# EAGLE design rover (EAGLE 7.7.0)

## Sheet 1 of 4
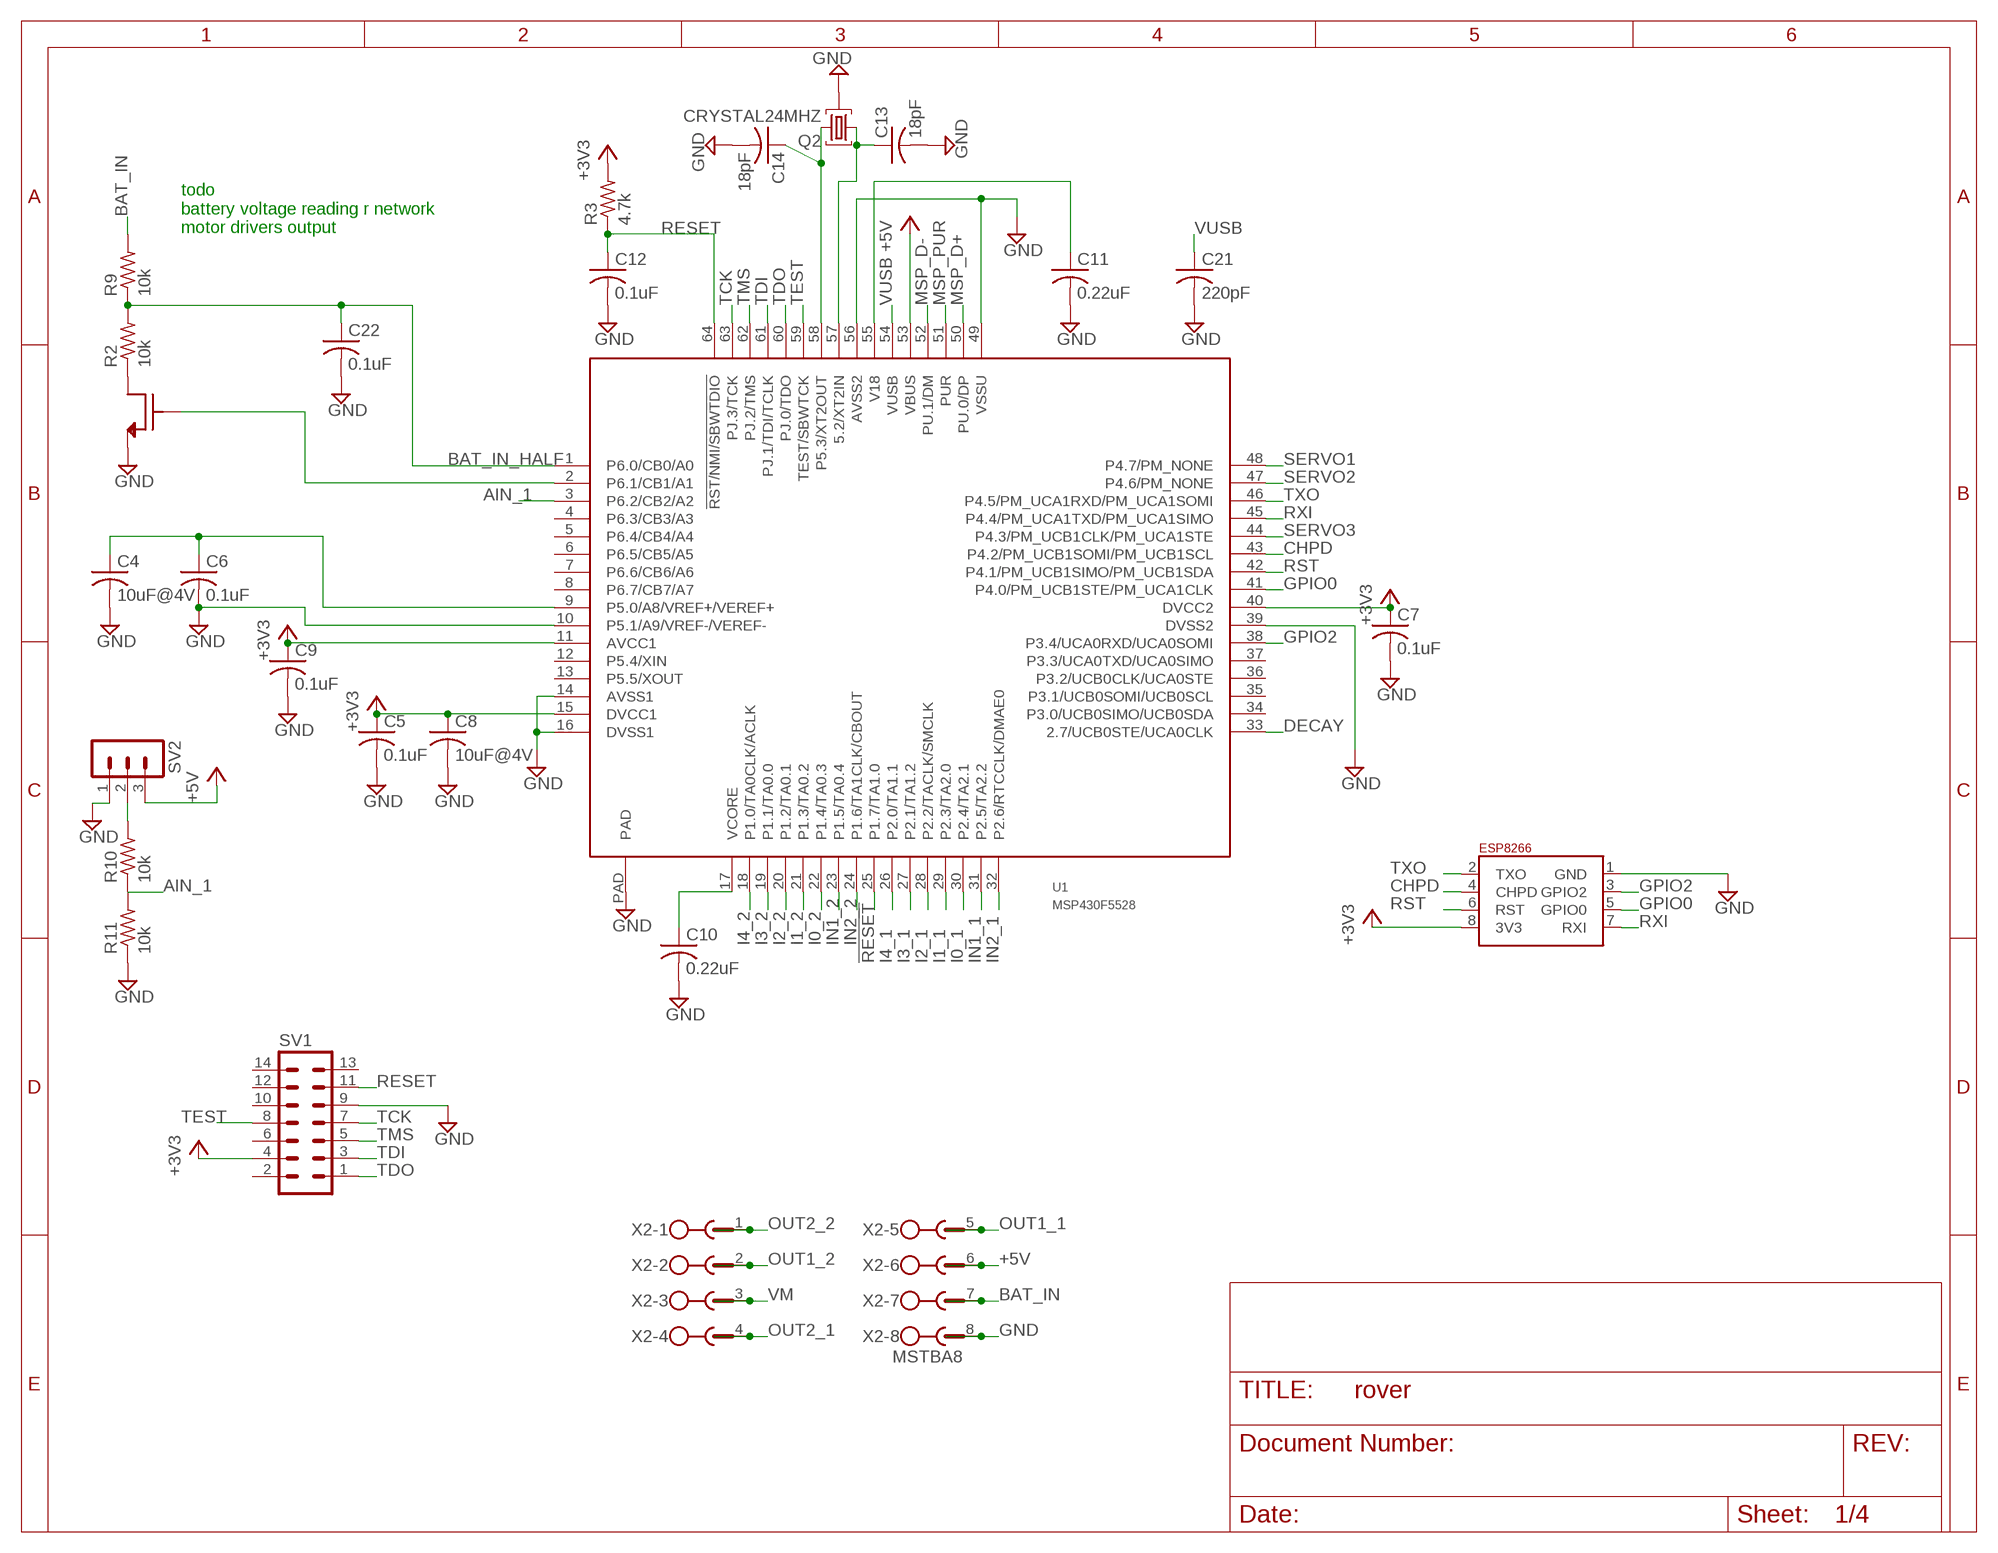
[diagram p0: schematic, sheet 1]

### Parts
C4  10uF@4V  C-US10UFC0603  [C0603]
C5  0.1uF  C-US0.1UFC0603  [C0603]
C6  0.1uF  C-US0.1UFC0603  [C0603]
C7  0.1uF  C-US0.1UFC0603  [C0603]
C8  10uF@4V  C-US10UFC0603  [C0603]
C9  0.1uF  C-US0.1UFC0603  [C0603]
C10  0.22uF  C-US0.22UFC0603  [C0603]
C11  0.22uF  C-US0.22UFC0603  [C0603]
C12  0.1uF  C-US0.1UFC0603  [C0603]
C13  18pF  C-US18PFC0603  [C0603]
C14  18pF  C-US18PFC0603  [C0603]
C21  220pF  C-US-220PF-C0603  [C0603]
C22  0.1uF  C-US0.1UFC0603  [C0603]
Q2  CRYSTAL24MHZ  [ABM8]
R2  10k  R-US_10KR0603  [R0603]
R3  4.7k  R-US_4.7KR0603  [R0603]
R9  10k  R-US_10KR0603  [R0603]
R10  10k  R-US_10KR0603  [R0603]
R11  10k  R-US_10KR0603  [R0603]
SV1  MA07-2THM  [MA07-2]
SV2  MA03-1RND  [MA03-1-ROUND]
U1  MSP430F5528  [-RGC-N64]
U3  NMOS2N7002P  [2N7002P-235]
U15  ESP8266  [ESP8266]
X2  MSTBA8  [MSTBA8]

### Nets
!RESET: U1.25(P1.7/TA1.0) ; also sheet 3,4
+3V3: C5.1 C7.1 C8.1 C9.1 R3.2 SV1.4 U1.11(AVCC1) U1.15(DVCC1) U1.40(DVCC2) U15.8(3V3) ; also sheet 2,3,4
+5V: SV2.3 U1.53(VBUS) X2.6 ; also sheet 2
AIN_1: R10.1 R11.2 U1.3(P6.2/CB2/A2)
BAT_IN: R9.2 X2.7
BAT_IN_HALF: C22.1 R2.2 R9.1 U1.1(P6.0/CB0/A0)
CHPD: U1.43(P4.2/PM_UCB1SOMI/PM_UCB1SCL) U15.4(CHPD)
DECAY: U1.33(2.7/UCB0STE/UCA0CLK) ; also sheet 3,4
GND: C4.2 C5.2 C6.2 C7.2 C8.2 C9.2 C10.2 C11.2 C12.2 C13.2 C14.2 C21.2 C22.2 Q2.2 Q2.4 R11.1 SV1.9 SV2.1 U1.10(P5.1/A9/VREF-/VEREF-) U1.14(AVSS1) U1.16(DVSS1) U1.39(DVSS2) U1.49(VSSU) U1.56(AVSS2) U1.PAD U3.3(D) U15.1(GND) X2.8 ; also sheet 2,3,4
GPIO0: U1.41(P4.0/PM_UCB1STE/PM_UCA1CLK) U15.5(GPIO0)
GPIO2: U1.38(P3.4/UCA0RXD/UCA0SOMI) U15.3(GPIO2)
I0_1: U1.30(P2.4/TA2.1) ; also sheet 3
I0_2: U1.22(P1.4/TA0.3) ; also sheet 4
I1_1: U1.29(P2.3/TA2.0) ; also sheet 3
I1_2: U1.21(P1.3/TA0.2) ; also sheet 4
I2_1: U1.28(P2.2/TACLK/SMCLK) ; also sheet 3
I2_2: U1.20(P1.2/TA0.1) ; also sheet 4
I3_1: U1.27(P2.1/TA1.2) ; also sheet 3
I3_2: U1.19(P1.1/TA0.0) ; also sheet 4
I4_1: U1.26(P2.0/TA1.1) ; also sheet 3
I4_2: U1.18(P1.0/TA0CLK/ACLK) ; also sheet 4
IN1_1: U1.31(P2.5/TA2.2) ; also sheet 3
IN1_2: U1.23(P1.5/TA0.4) ; also sheet 4
IN2_1: U1.32(P2.6/RTCCLK/DMAE0) ; also sheet 3
IN2_2: U1.24(P1.6/TA1CLK/CBOUT) ; also sheet 4
MSP_D+: U1.50(PU.0/DP) ; also sheet 2
MSP_D-: U1.52(PU.1/DM) ; also sheet 2
MSP_PUR: U1.51(PUR) ; also sheet 2
N$1: R2.1 U3.2(S)
N$2: C11.1 U1.55(V18)
N$3: C10.1 U1.17(VCORE)
N$4: U1.2(P6.1/CB1/A1) U3.1(G)
N$5: C13.1 Q2.1 U1.57(5.2/XT2IN)
N$6: C14.1 Q2.3 U1.58(P5.3/XT2OUT)
N$8: R10.2 SV2.2
N$13: C4.1 C6.1 U1.9(P5.0/A8/VREF+/VEREF+)
OUT1_1: X2.5 ; also sheet 3
OUT1_2: X2.2 ; also sheet 4
OUT2_1: X2.4 ; also sheet 3
OUT2_2: X2.1 ; also sheet 4
RESET: C12.1 R3.1 SV1.11 U1.64(!RST/NMI/SBWTDIO)
RST: U1.42(P4.1/PM_UCB1SIMO/PM_UCB1SDA) U15.6(RST)
RXI: U1.45(P4.4/PM_UCA1TXD/PM_UCA1SIMO) U15.7(RXI)
SERVO1: U1.48(P4.7/PM_NONE) ; also sheet 2
SERVO2: U1.47(P4.6/PM_NONE) ; also sheet 2
SERVO3: U1.44(P4.3/PM_UCB1CLK/PM_UCA1STE) ; also sheet 2
TCK: SV1.7 U1.63(PJ.3/TCK)
TDI: SV1.3 U1.61(PJ.1/TDI/TCLK)
TDO: SV1.1 U1.60(PJ.0/TDO)
TEST: SV1.8 U1.59(TEST/SBWTCK)
TMS: SV1.5 U1.62(PJ.2/TMS)
TXO: U1.46(P4.5/PM_UCA1RXD/PM_UCA1SOMI) U15.2(TXO)
VM: X2.3 ; also sheet 3,4
VUSB: C21.1 U1.54(VUSB)
Unconnected: SV1.2 SV1.6 SV1.10 SV1.12 SV1.13 SV1.14 U1.4(P6.3/CB3/A3) U1.5(P6.4/CB4/A4) U1.6(P6.5/CB5/A5) U1.7(P6.6/CB6/A6) U1.8(P6.7/CB7/A7) U1.12(P5.4/XIN) U1.13(P5.5/XOUT) U1.34(P3.0/UCB0SIMO/UCB0SDA) U1.35(P3.1/UCB0SOMI/UCB0SCL) U1.36(P3.2/UCB0CLK/UCA0STE) U1.37(P3.3/UCA0TXD/UCA0SIMO)

### Notes on the sheet
- todo
  battery voltage reading r network
  motor drivers output

## Sheet 2 of 4
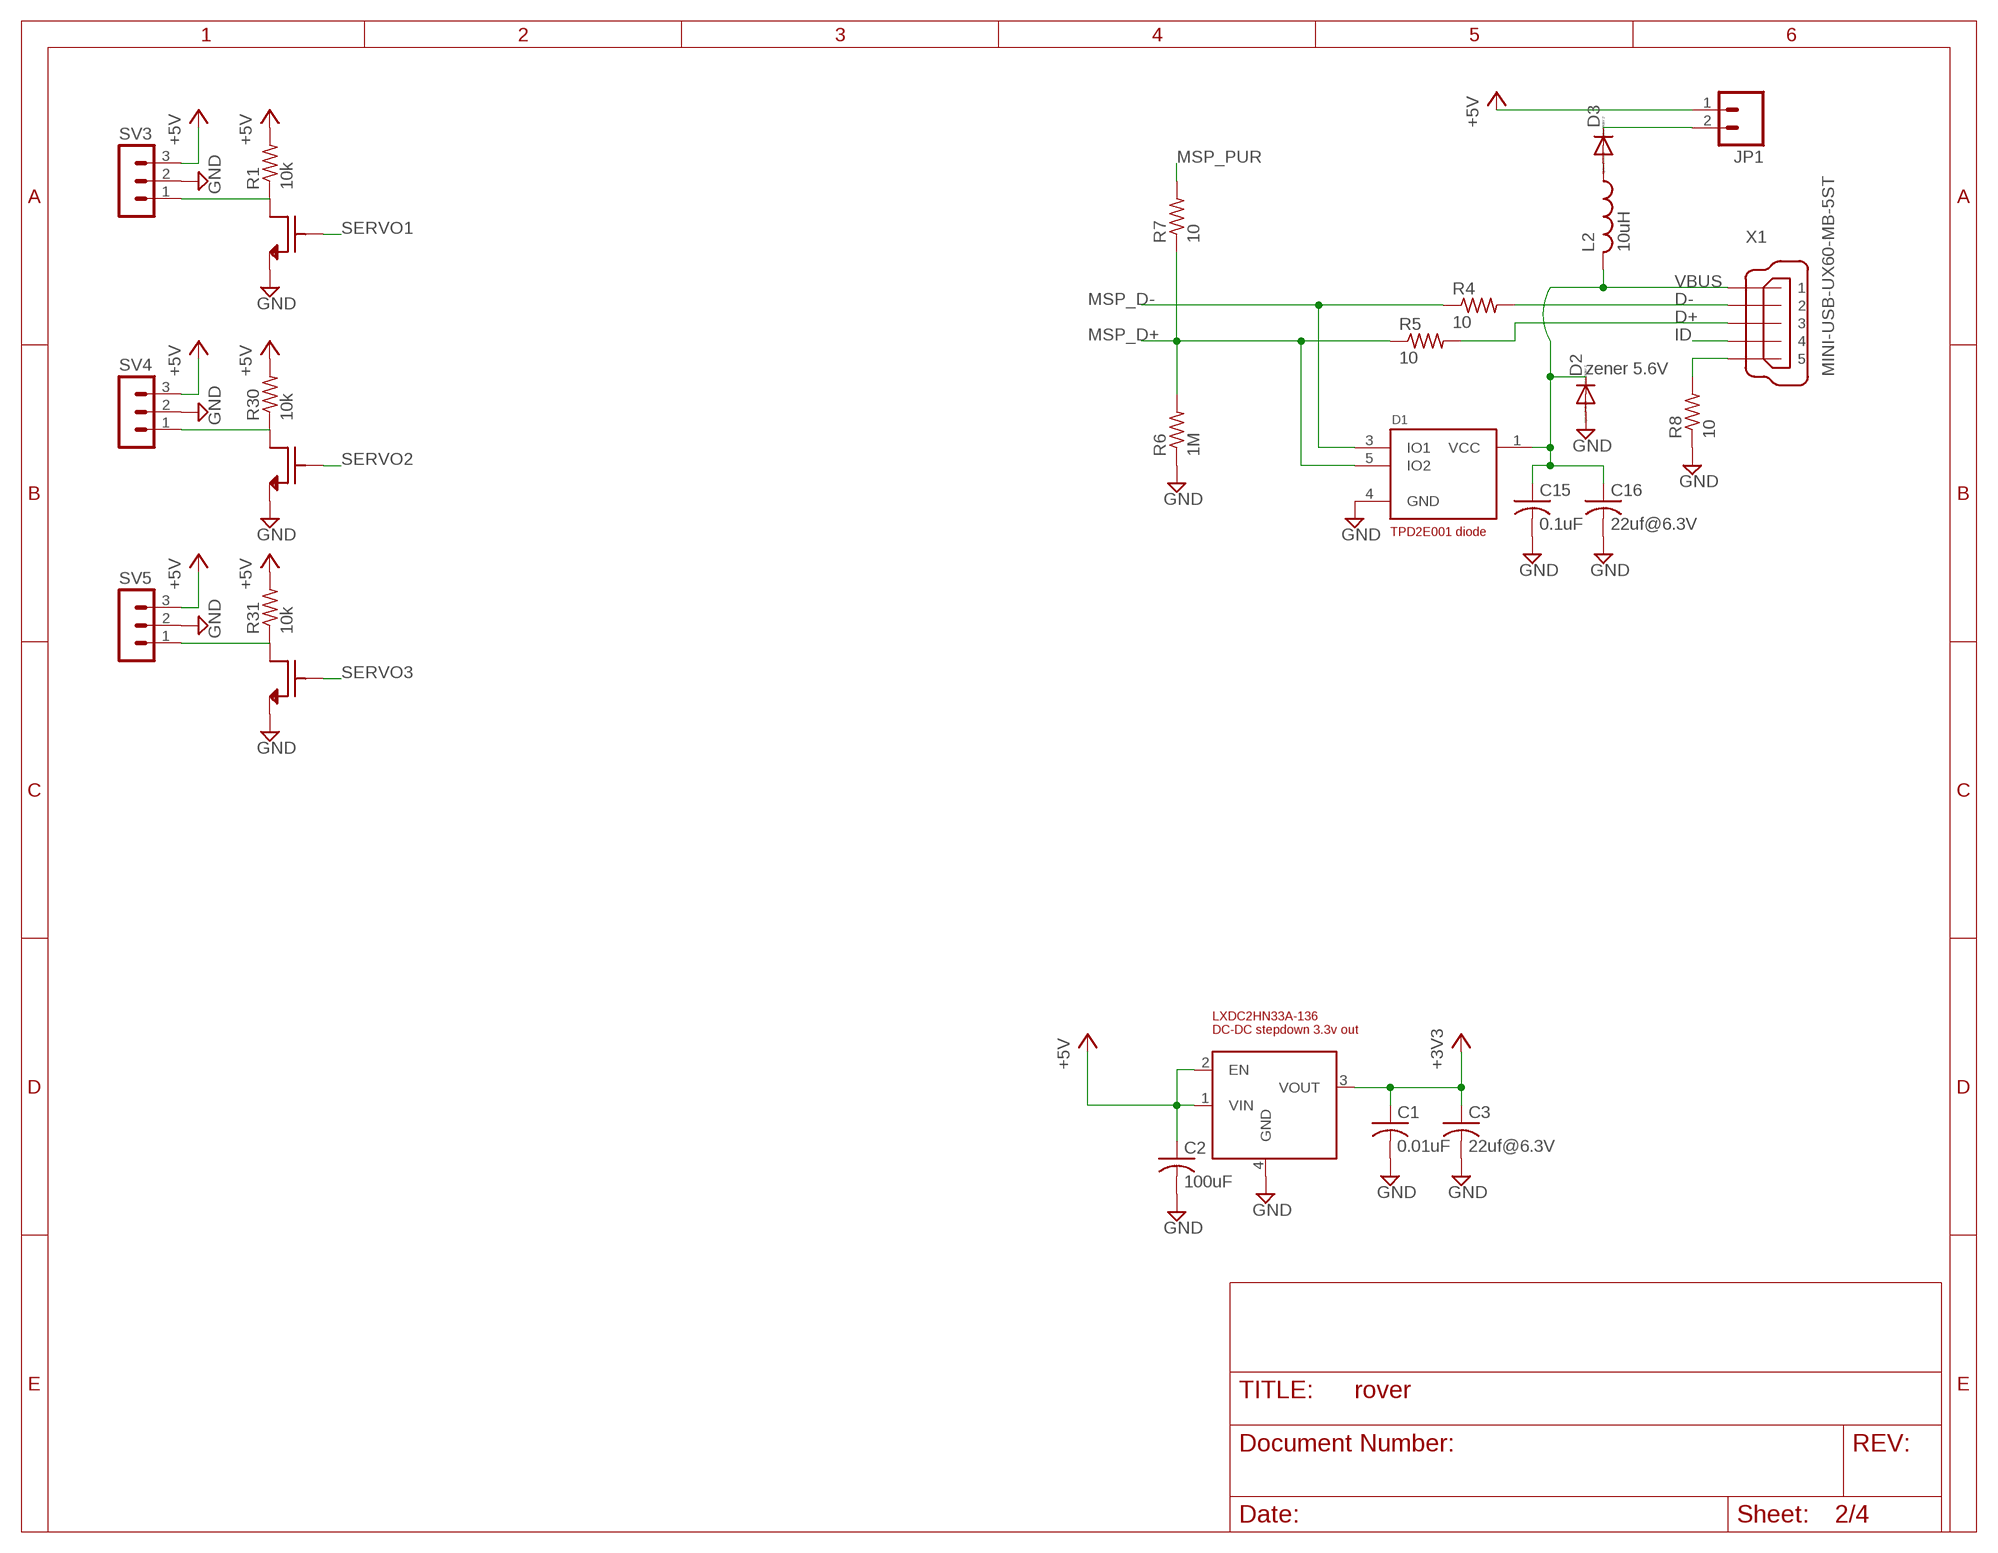
[diagram p1: schematic, sheet 2]

### Parts
C1  0.01uF  C-US-0.01UF-C0603  [C0603]
C2  100uF  C-US100UF  [875105344010]
C3  22uf@6.3V  C-US22UFC0603  [C0603]
C15  0.1uF  C-US0.1UFC0603  [C0603]
C16  22uf@6.3V  C-US22UFC0603  [C0603]
D1  USB-DIODE  [-DRL]
D2  zener 5.6V  DIODE-SOD123  [SOD123]
D3  DIODE-  [DB2X20700L]
JP1  M02PTH  [1X02]
L2  10uH  L-US-10UH-VLS201610ET  [VLS201610ET]
R1  10k  R-US_10KR0603  [R0603]
R4  10  R-US_10R0603  [R0603]
R5  10  R-US_10R0603  [R0603]
R6  1M  R-US_1MR0603  [R0603]
R7  10  R-US_10R0603  [R0603]
R8  10  R-US_10R0603  [R0603]
R30  10k  R-US_10KR0603  [R0603]
R31  10k  R-US_10KR0603  [R0603]
SV3  MA03-1RND  [MA03-1-ROUND]
SV4  MA03-1RND  [MA03-1-ROUND]
SV5  MA03-1RND  [MA03-1-ROUND]
U2  LXDC2HN33A-136  [LXDC2HN33A-136]
U8  NMOS2N7002P  [2N7002P-235]
U9  NMOS2N7002P  [2N7002P-235]
U10  NMOS2N7002P  [2N7002P-235]
X1  MINI-USB-UX60-MB-5ST  [UX60-MB-5ST]

### Nets
+3V3: C1.1 C3.1 U2.3(VOUT) ; also sheet 1,3,4
+5V: C2.P$1 JP1.1 R1.2 R30.2 R31.2 SV3.3 SV4.3 SV5.3 U2.1(VIN) U2.2(EN) ; also sheet 1
D+: R5.2 X1.3
D-: R4.2 X1.2
GND: C1.2 C2.P$2 C3.2 C15.2 C16.2 D1.4(GND) D2.A R6.1 R8.1 SV3.2 SV4.2 SV5.2 U2.4(GND) U8.3(D) U9.3(D) U10.3(D) ; also sheet 1,3,4
ID: X1.4
MSP_D+: D1.5(IO2) R5.1 R6.2 R7.1 ; also sheet 1
MSP_D-: D1.3(IO1) R4.1 ; also sheet 1
MSP_PUR: R7.2 ; also sheet 1
N$7: R8.2 X1.5
N$9: D3.P$1(A) L2.P$1
N$11: D3.P$2(C) JP1.2
N$12: R1.1 SV3.1 U8.2(S)
N$14: R30.1 SV4.1 U9.2(S)
N$16: R31.1 SV5.1 U10.2(S)
SERVO1: U8.1(G) ; also sheet 1
SERVO2: U9.1(G) ; also sheet 1
SERVO3: U10.1(G) ; also sheet 1
VBUS: C15.1 C16.1 D1.1(VCC) D2.C L2.P$2 X1.1

## Sheet 3 of 4
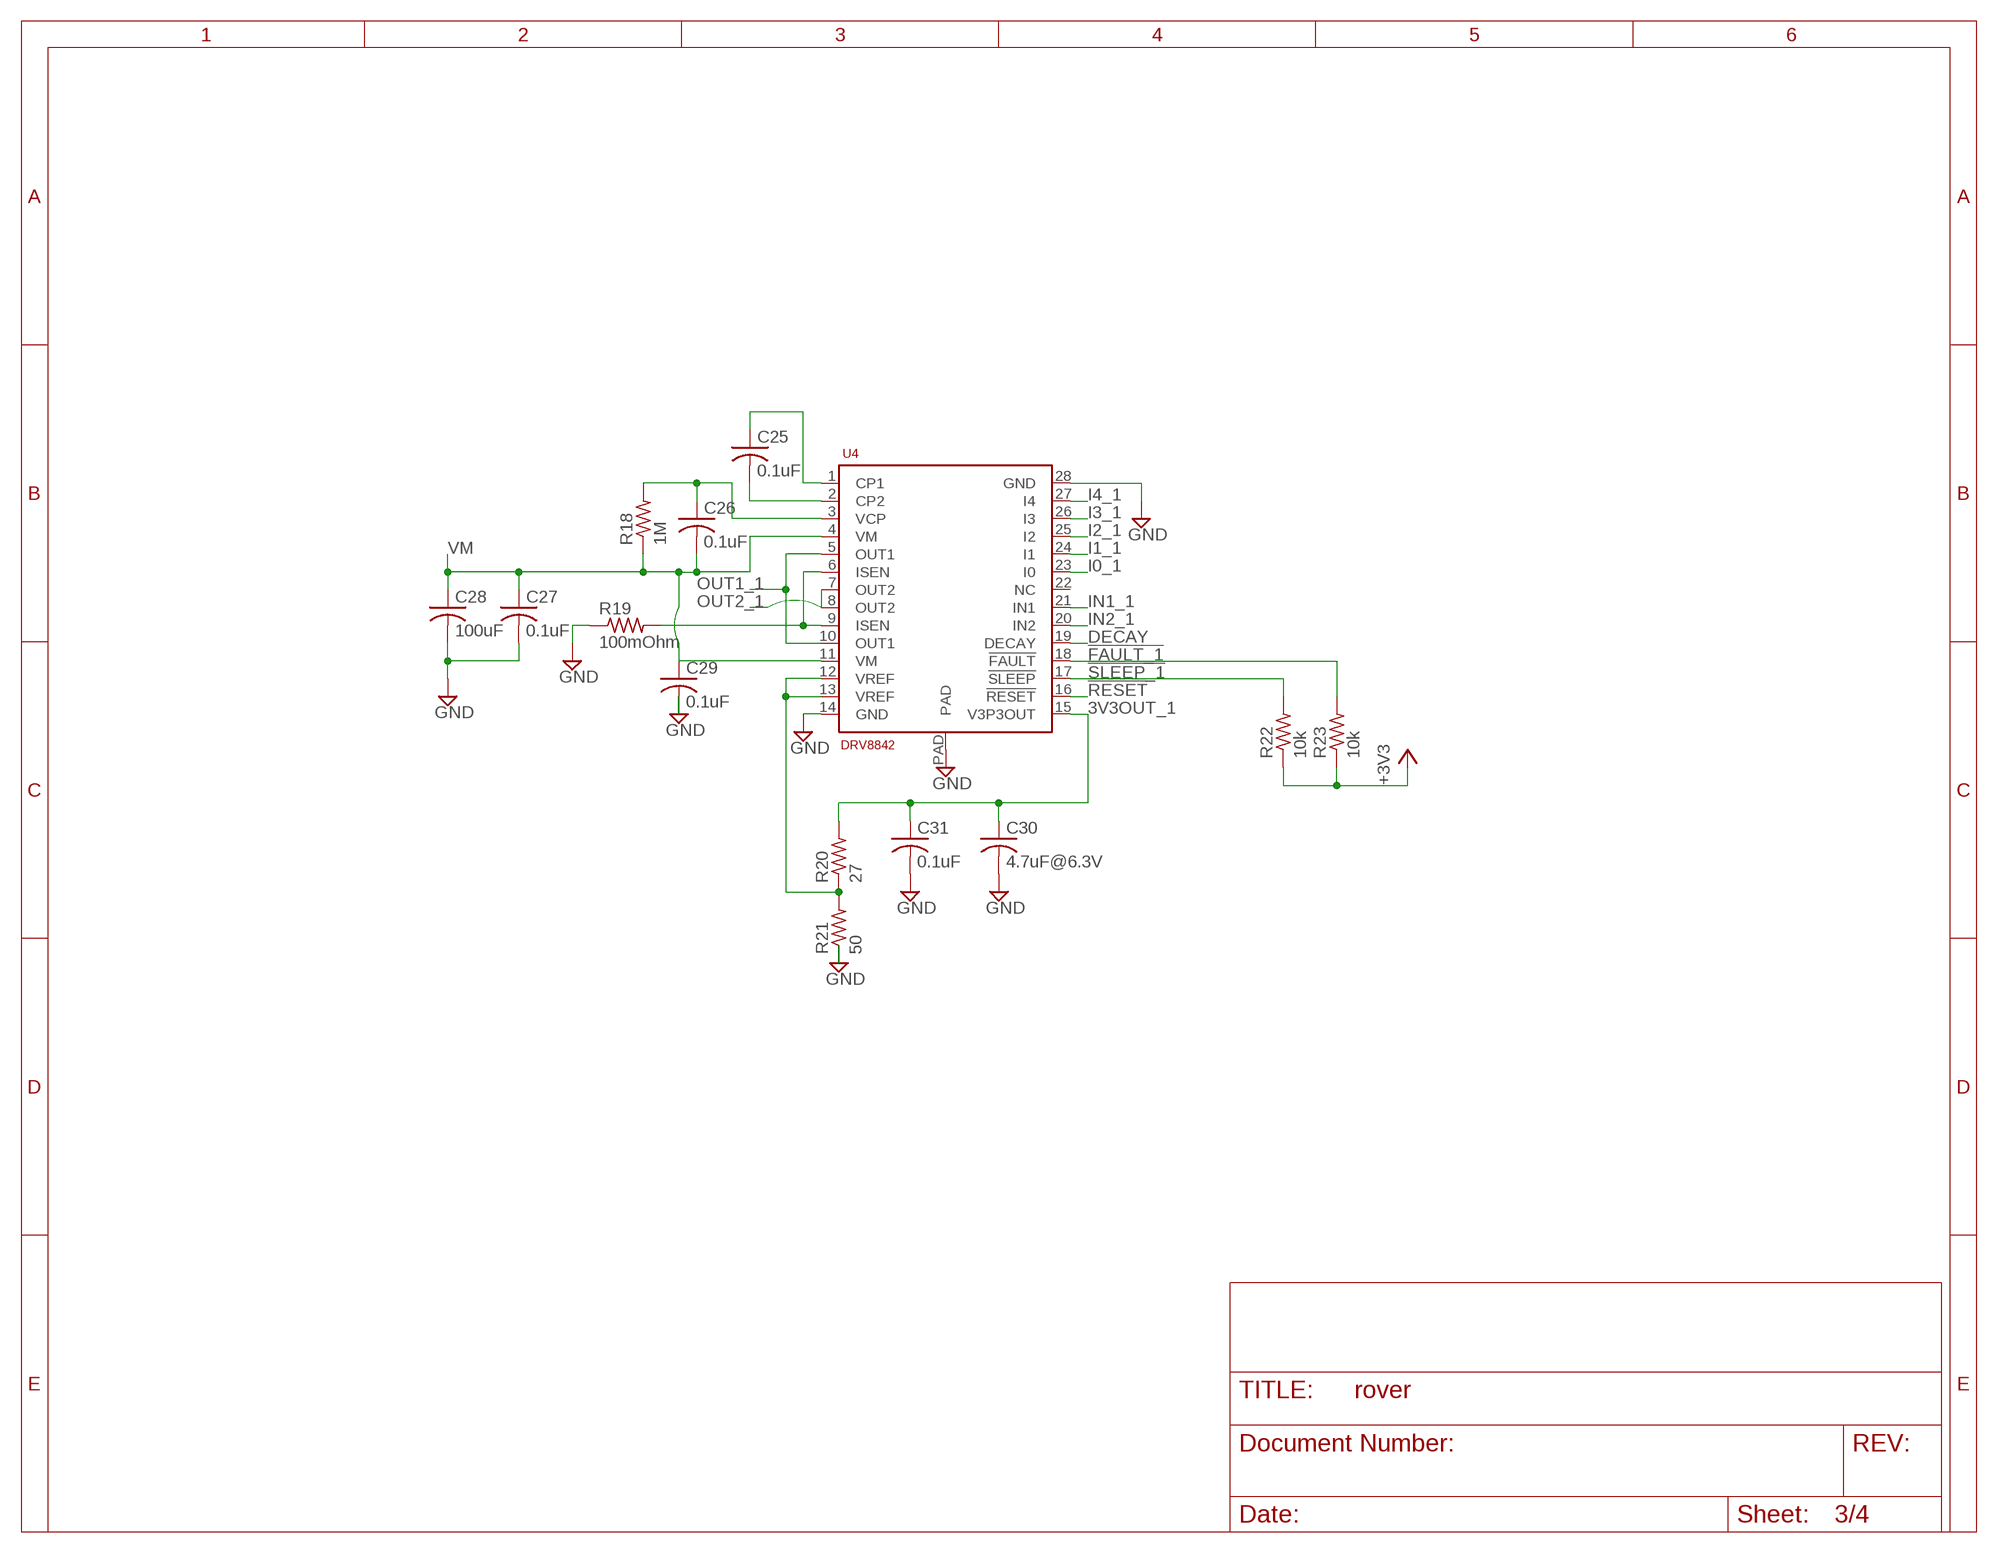
[diagram p2: schematic, sheet 3]

### Parts
C25  0.1uF  C-US0.1UFC0603  [C0603]
C26  0.1uF  C-US0.1UFC0603  [C0603]
C27  0.1uF  C-US0.1UFC0603  [C0603]
C28  100uF  C-US100UF  [875105344010]
C29  0.1uF  C-US0.1UFC0603  [C0603]
C30  4.7uF@6.3V  C-US4.7UFC0603  [C0603]
C31  0.1uF  C-US0.1UFC0603  [C0603]
R18  1M  R-US_1MR0603  [R0603]
R19  100mOhm  R-US_100MILIR0603  [R0603]
R20  27  R-US_27R0603  [R0603]
R21  50  R-US_50R0603  [R0603]
R22  10k  R-US_10KR0603  [R0603]
R23  10k  R-US_10KR0603  [R0603]
U4  DRV8842  [-PWP]

### Nets
3V3OUT_1: C30.1 C31.1 R20.2 U4.15(V3P3OUT)
!FAULT_1: R23.2 U4.18(!FAULT)
!RESET: U4.16(!RESET) ; also sheet 1,4
!SLEEP_1: R22.2 U4.17(!SLEEP)
+3V3: R22.1 R23.1 ; also sheet 1,2,4
CP1: C25.2 U4.2(CP2)
CP2: C25.1 U4.1(CP1)
DECAY: U4.19(DECAY) ; also sheet 1,4
GND: C27.2 C28.P$2 C29.2 C30.2 C31.2 R19.1 R21.1 U4.14(GND) U4.28(GND) U4.PAD ; also sheet 1,2,4
I0_1: U4.23(I0) ; also sheet 1
I1_1: U4.24(I1) ; also sheet 1
I2_1: U4.25(I2) ; also sheet 1
I3_1: U4.26(I3) ; also sheet 1
I4_1: U4.27(I4) ; also sheet 1
IN1_1: U4.21(IN1) ; also sheet 1
IN2_1: U4.20(IN2) ; also sheet 1
ISEN: R19.2 U4.6(ISEN) U4.9(ISEN)
OUT1_1: U4.5(OUT1) U4.10(OUT1) ; also sheet 1
OUT2_1: U4.7(OUT2) U4.8(OUT2) ; also sheet 1
VCP: C26.1 R18.2 U4.3(VCP)
VM: C26.2 C27.1 C28.P$1 C29.1 R18.1 U4.4(VM) U4.11(VM) ; also sheet 1,4
VREF: R20.1 R21.2 U4.12(VREF) U4.13(VREF)
Unconnected: U4.22(NC)

## Sheet 4 of 4
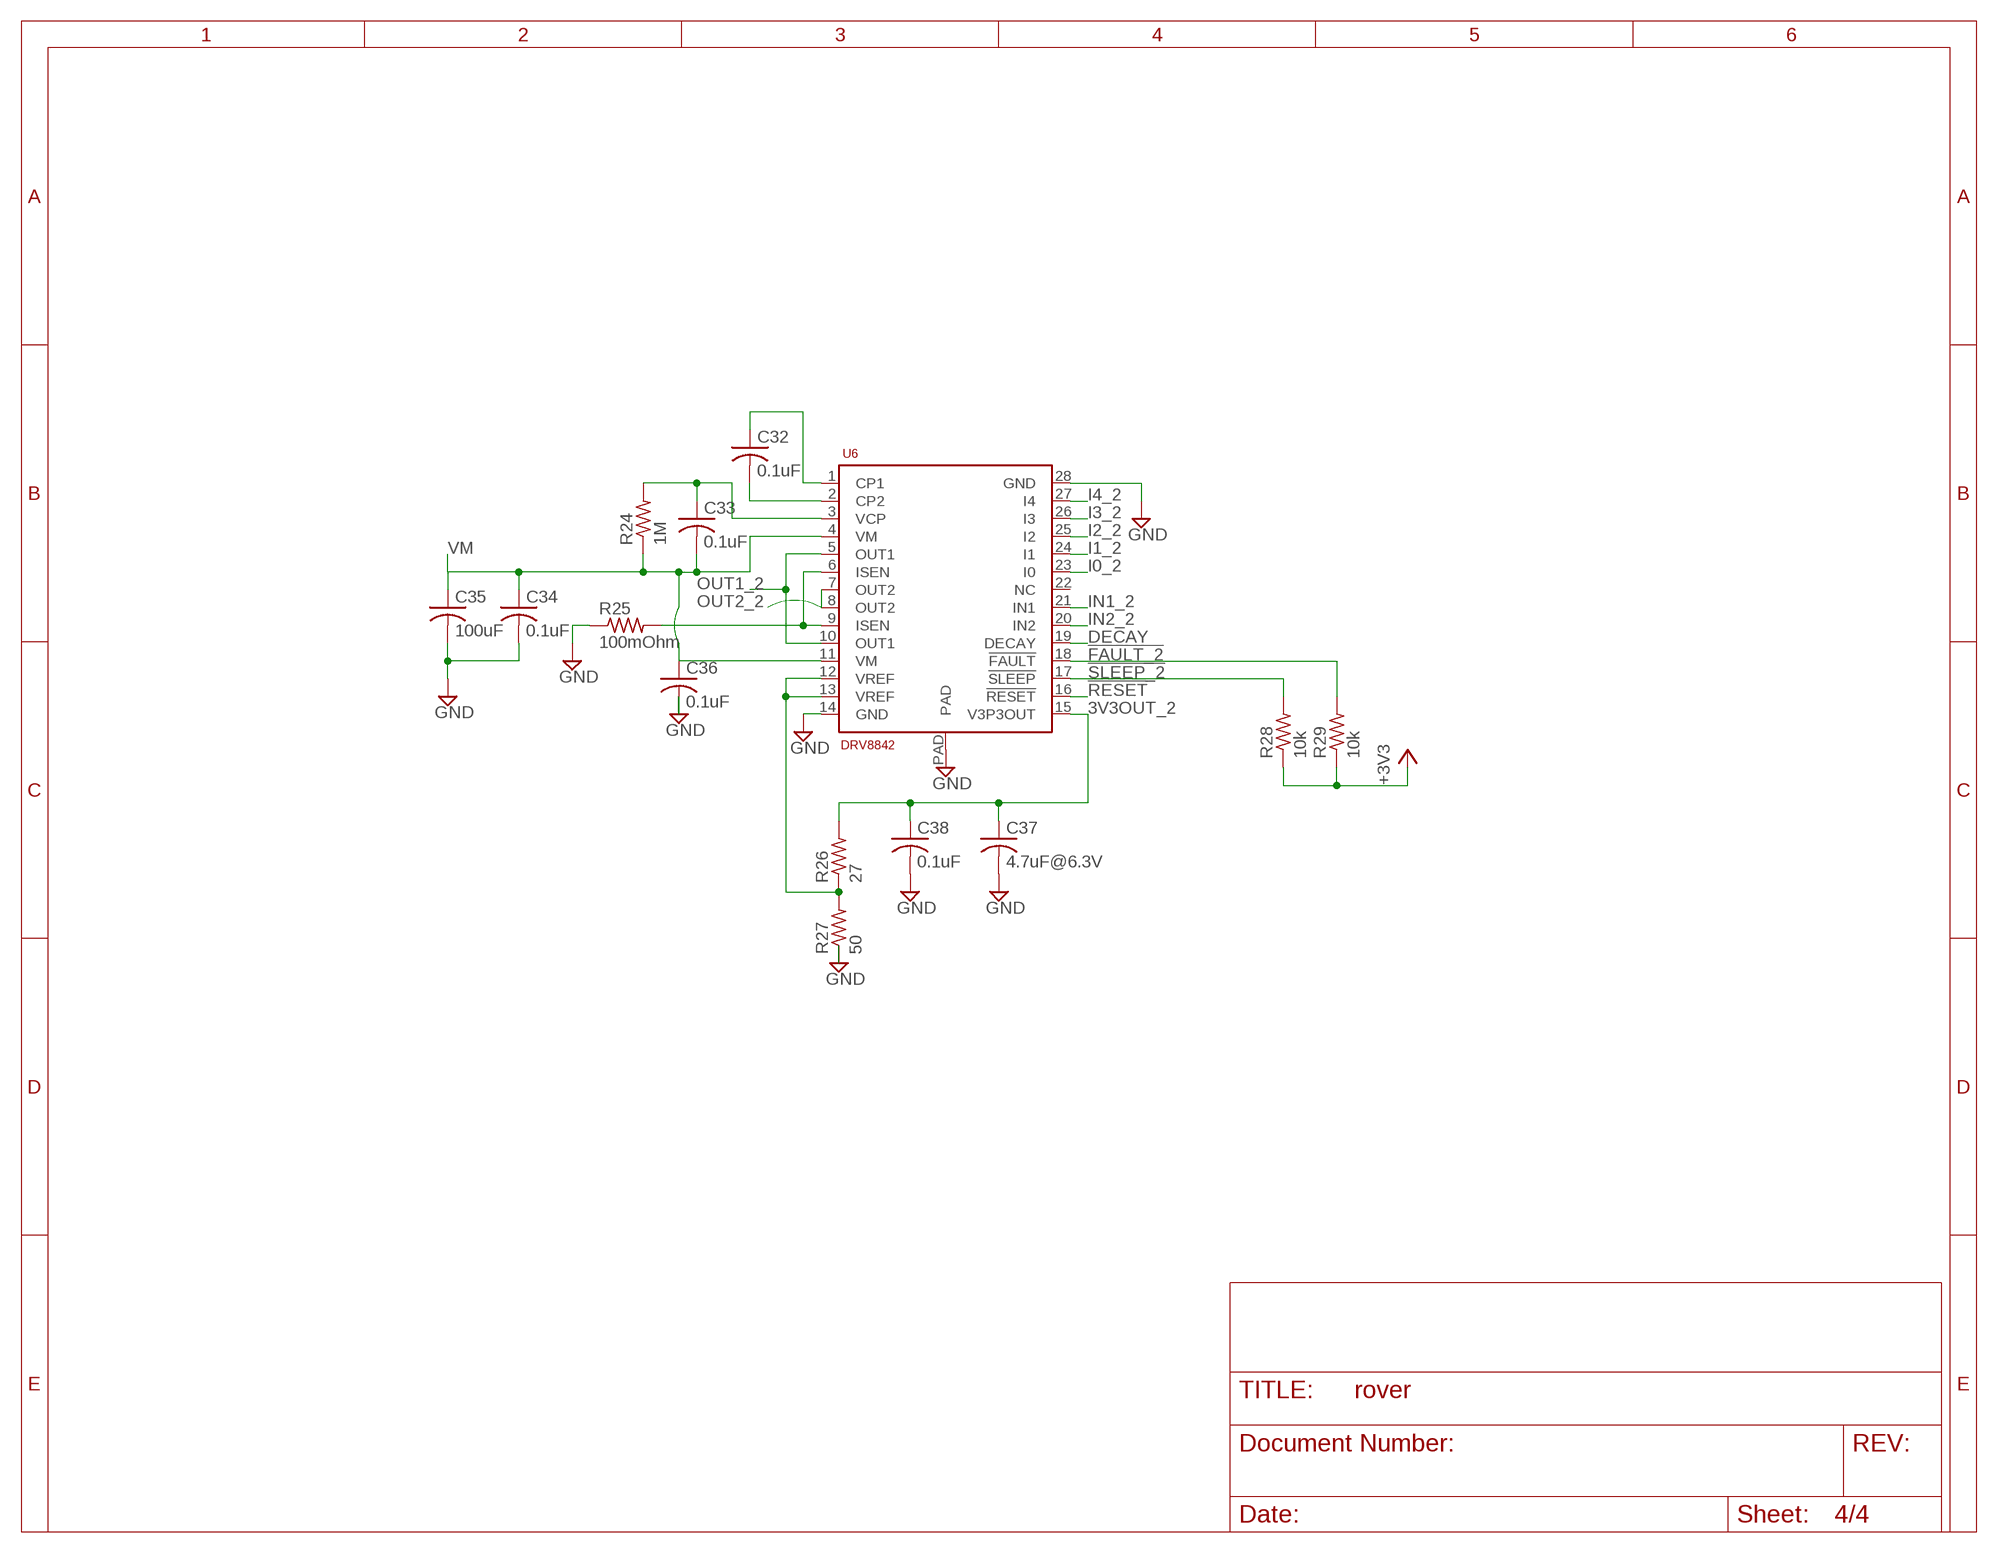
[diagram p3: schematic, sheet 4]

### Parts
C32  0.1uF  C-US0.1UFC0603  [C0603]
C33  0.1uF  C-US0.1UFC0603  [C0603]
C34  0.1uF  C-US0.1UFC0603  [C0603]
C35  100uF  C-US100UF  [875105344010]
C36  0.1uF  C-US0.1UFC0603  [C0603]
C37  4.7uF@6.3V  C-US4.7UFC0603  [C0603]
C38  0.1uF  C-US0.1UFC0603  [C0603]
R24  1M  R-US_1MR0603  [R0603]
R25  100mOhm  R-US_100MILIR0603  [R0603]
R26  27  R-US_27R0603  [R0603]
R27  50  R-US_50R0603  [R0603]
R28  10k  R-US_10KR0603  [R0603]
R29  10k  R-US_10KR0603  [R0603]
U6  DRV8842  [-PWP]

### Nets
3V3OUT_2: C37.1 C38.1 R26.2 U6.15(V3P3OUT)
!FAULT_2: R29.2 U6.18(!FAULT)
!RESET: U6.16(!RESET) ; also sheet 1,3
!SLEEP_2: R28.2 U6.17(!SLEEP)
+3V3: R28.1 R29.1 ; also sheet 1,2,3
CP3: C32.2 U6.2(CP2)
CP4: C32.1 U6.1(CP1)
DECAY: U6.19(DECAY) ; also sheet 1,3
GND: C34.2 C35.P$2 C36.2 C37.2 C38.2 R25.1 R27.1 U6.14(GND) U6.28(GND) U6.PAD ; also sheet 1,2,3
I0_2: U6.23(I0) ; also sheet 1
I1_2: U6.24(I1) ; also sheet 1
I2_2: U6.25(I2) ; also sheet 1
I3_2: U6.26(I3) ; also sheet 1
I4_2: U6.27(I4) ; also sheet 1
IN1_2: U6.21(IN1) ; also sheet 1
IN2_2: U6.20(IN2) ; also sheet 1
ISEN1: R25.2 U6.6(ISEN) U6.9(ISEN)
OUT1_2: U6.5(OUT1) U6.10(OUT1) ; also sheet 1
OUT2_2: U6.7(OUT2) U6.8(OUT2) ; also sheet 1
VCP1: C33.1 R24.2 U6.3(VCP)
VM: C33.2 C34.1 C35.P$1 C36.1 R24.1 U6.4(VM) U6.11(VM) ; also sheet 1,3
VREF1: R26.1 R27.2 U6.12(VREF) U6.13(VREF)
Unconnected: U6.22(NC)

## Library data of the parts
C1 = myLib:C-US: CAPACITOR, American symbol; MFG: murata; MPN: GRM1885C1H103JA01D
C2 C28 C35 = myLib:C-US: CAPACITOR, American symbol; MFG: wurth; MPN: 875105344010
C3 C16 = myLib:C-US: CAPACITOR, American symbol; MFG: samsung; MPN: CL10A226MQ8NRNC
C4 C8 = myLib:C-US: CAPACITOR, American symbol; MFG: murata; MPN: GRM188R60G106ME47D
C5-C7 C9 C12 C15 C22 C25-C27 C29 C31-C34 C36 C38 = myLib:C-US: CAPACITOR, American symbol; MFG: yageo; MPN: CC0603KRX7R7BB104
C10 C11 = myLib:C-US: CAPACITOR, American symbol; MFG: samsung; MPN: CL10B224KO8NNNC
C13 C14 = myLib:C-US: CAPACITOR, American symbol; MFG: panasonic; MPN: CL10C180JB8NNNC
C21 = myLib:C-US: CAPACITOR, American symbol; MFG: murata; MPN: GRM1885C1H221JA01D
C30 C37 = myLib:C-US: CAPACITOR, American symbol; MFG: samsung; MPN: CL10B475KQ8NQNC
D1 = myLib:USB-DIODE; MFG: ti; MPN: TPD2E001DRLRG4
D2 = myLib:DIODE-: DIODE; MFG: diodes inc; MPN: MMSZ5232B-7-F
D3 = myLib:DIODE-: DIODE; MFG: panasonic; MPN: DB2X20700L
JP1 = SparkFun-Connectors:M02: Standard 2-pin 0.1" header. Use with - straight break away headers ( PRT-00116) - right angle break away headers (PRT-00553) - swiss pins (PRT-00743) - machine pins (PRT-00117) - female headers (PRT-00115) Molex polarized connector foot print use with: PRT-08233 with associated crimp pins and housings. 2.54_SCREWTERM for use with PRT-10571. 3.5mm Screw Terminal footprints for PRT-08084 5mm Screw Terminal footprints for use with PRT-08433
L2 = myLib:L-US: INDUCTOR, American symbol; MFG: tdk; MPN: VLS201610ET-100M
Q2 = myLib:CRYSTAL; MFG: Abracon; MPN: ABM8-24.000MHZ-B2-T
R1 R2 R9-R11 R22 R23 R28-R31 = myLib:R-US_: RESISTOR, American symbol; MFG: yageo; MPN: RC0603JR-0710KL
R3 = myLib:R-US_: RESISTOR, American symbol; MFG: panasonic; MPN: ERJ-3GEYJ472V
R4 R5 R7 R8 = myLib:R-US_: RESISTOR, American symbol; MFG: panasonic; MPN: ERJ-3EKF10R0V
R6 R18 R24 = myLib:R-US_: RESISTOR, American symbol; MFG: panasonic; MPN: ERJ-3EKF1004V
R19 R25 = myLib:R-US_: RESISTOR, American symbol; MFG: samsung; MPN: RU1608FR100CS
R20 R26 = myLib:R-US_: RESISTOR, American symbol; MFG: yageo; MPN: RC0603FR-0727RL
R21 R27 = myLib:R-US_: RESISTOR, American symbol; MFG: vishay; MPN: FC0603E50R0BST1
SV1 = myLib:MA07-2: PIN HEADER; OC_FARNELL: unknown; OC_NEWARK: unknown
SV2-SV5 = myLib:MA03-1: PIN HEADER
U1 = myLib:MSP430F5528; MFG: TI; MPN: MSP430F5528IRGCR
U2 = myLib:LXDC2HN33A-136; MFG: murata; MPN: LXDC2HN33A-136
U3 U8-U10 = myLib:NMOS; MFG: nxp; MPN: 2N7002P,235
U4 U6 = myLib:DRV8842; MFG: TI; MPN: DRV8842PWPR
U15 = myLib:ESP8266; MFG: expressive; MPN: esp8266
X1 = myLib:MINI-USB-: MINI USB Connector Source: http://www.hirose.co.jp/cataloge_hp/e24000019.pdf; MFG: Hirose; MPN: UX60-MB-5ST; OC_FARNELL: unknown; OC_NEWARK: unknown
X2 = myLib:MSTBA8: PHOENIX; MF: FARNELL; MFG: Phoenix; MPN: 1757307; OC_FARNELL: 3705225; OC_NEWARK: 71C4166

## Board
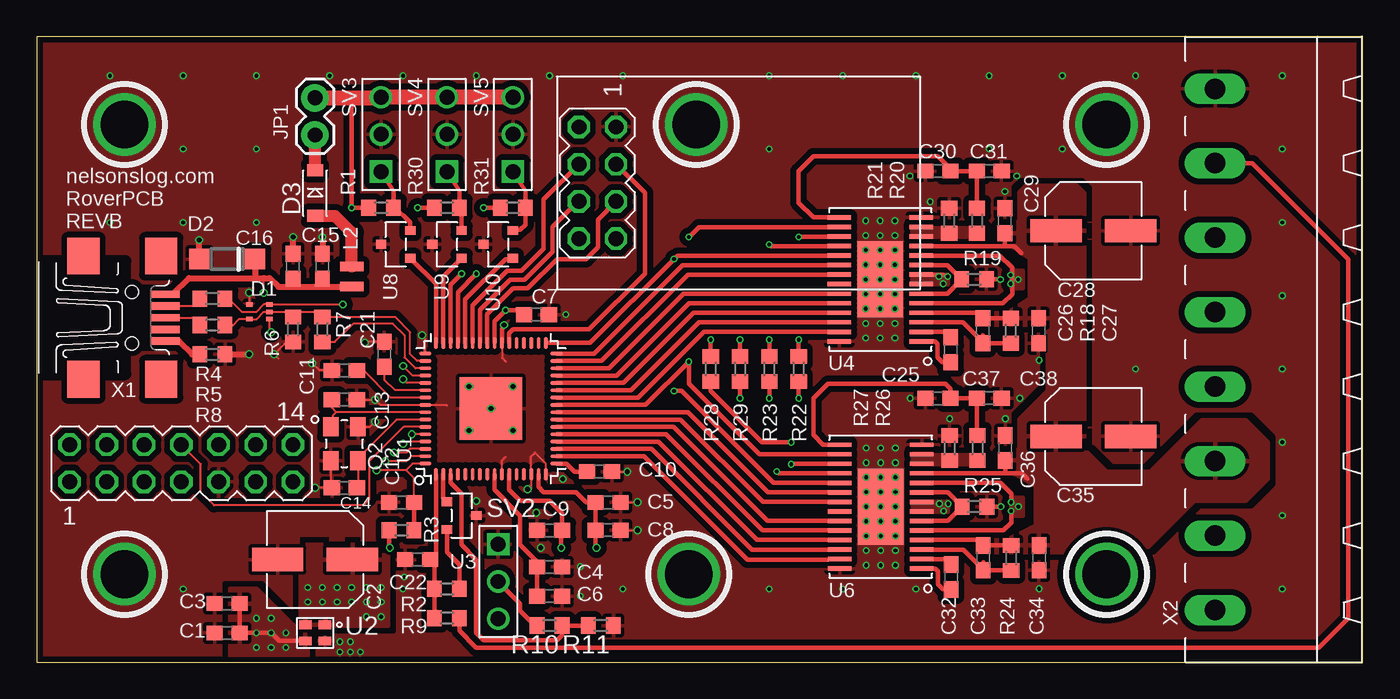
[diagram p4: board, top side]
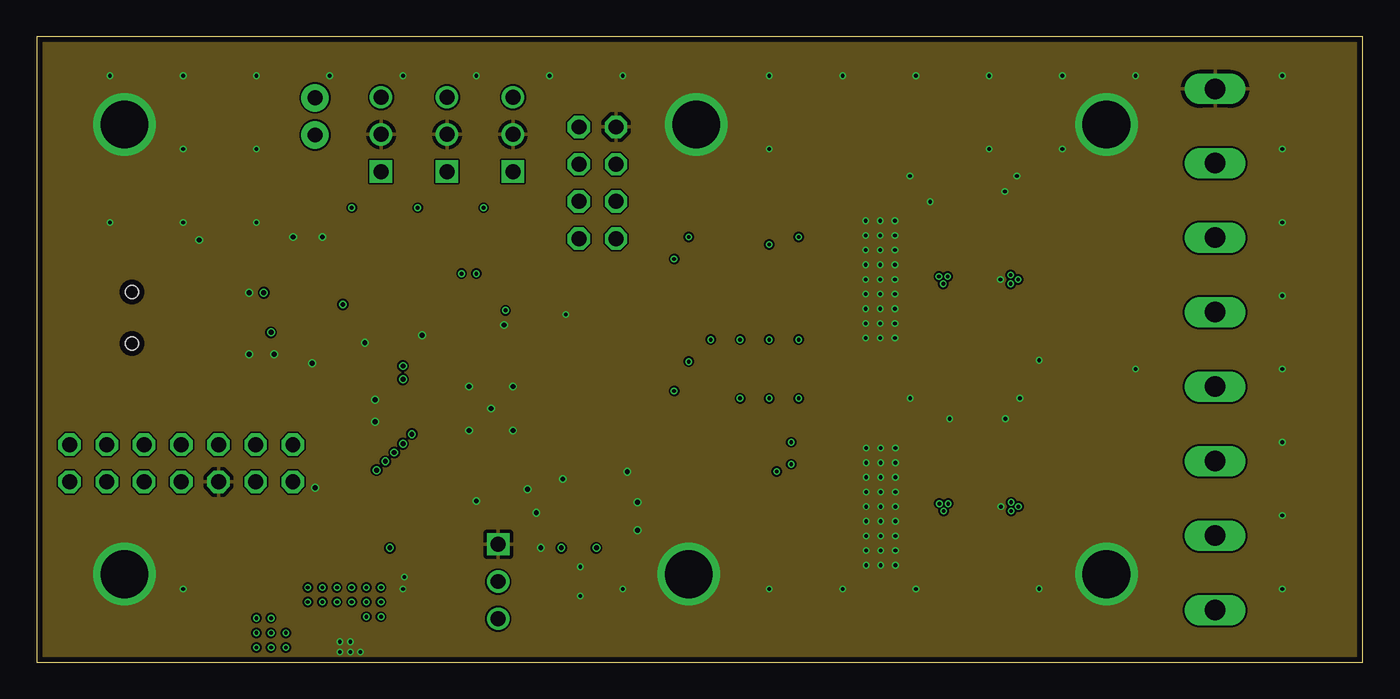
[diagram p5: board, inner layer Route2]
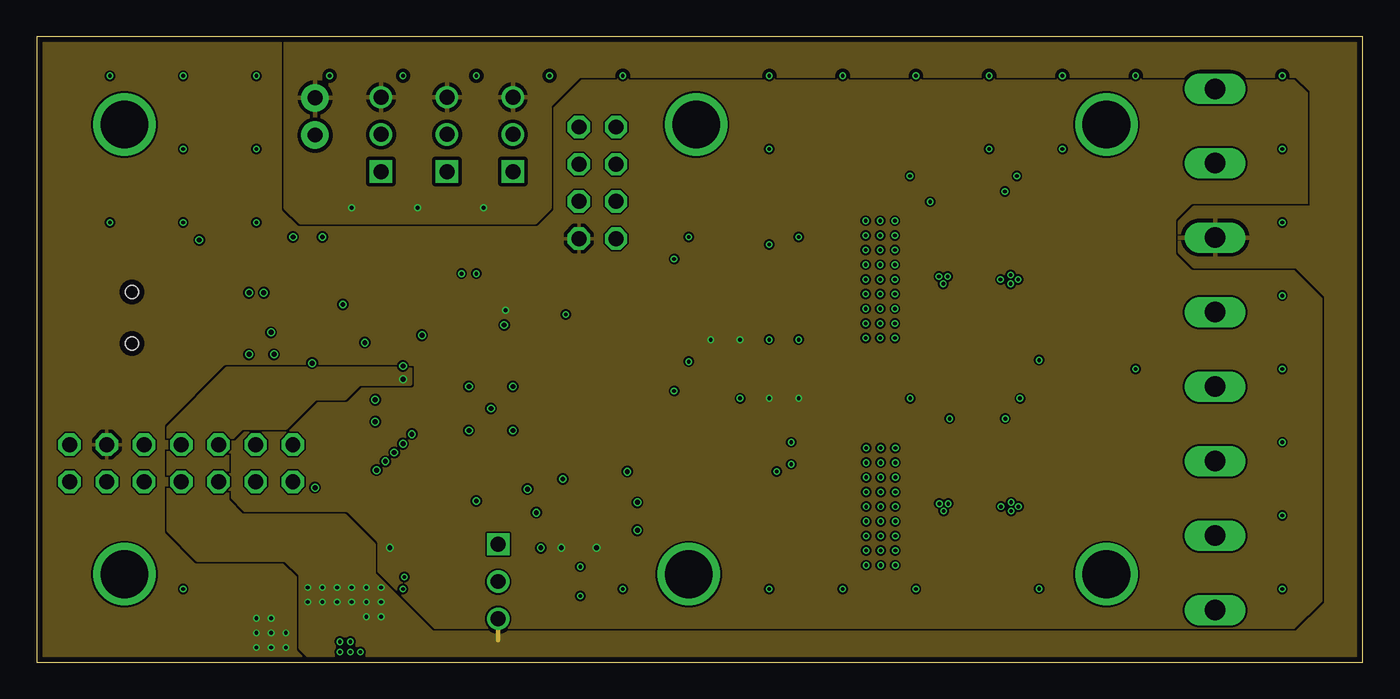
[diagram p6: board, inner layer Route15]
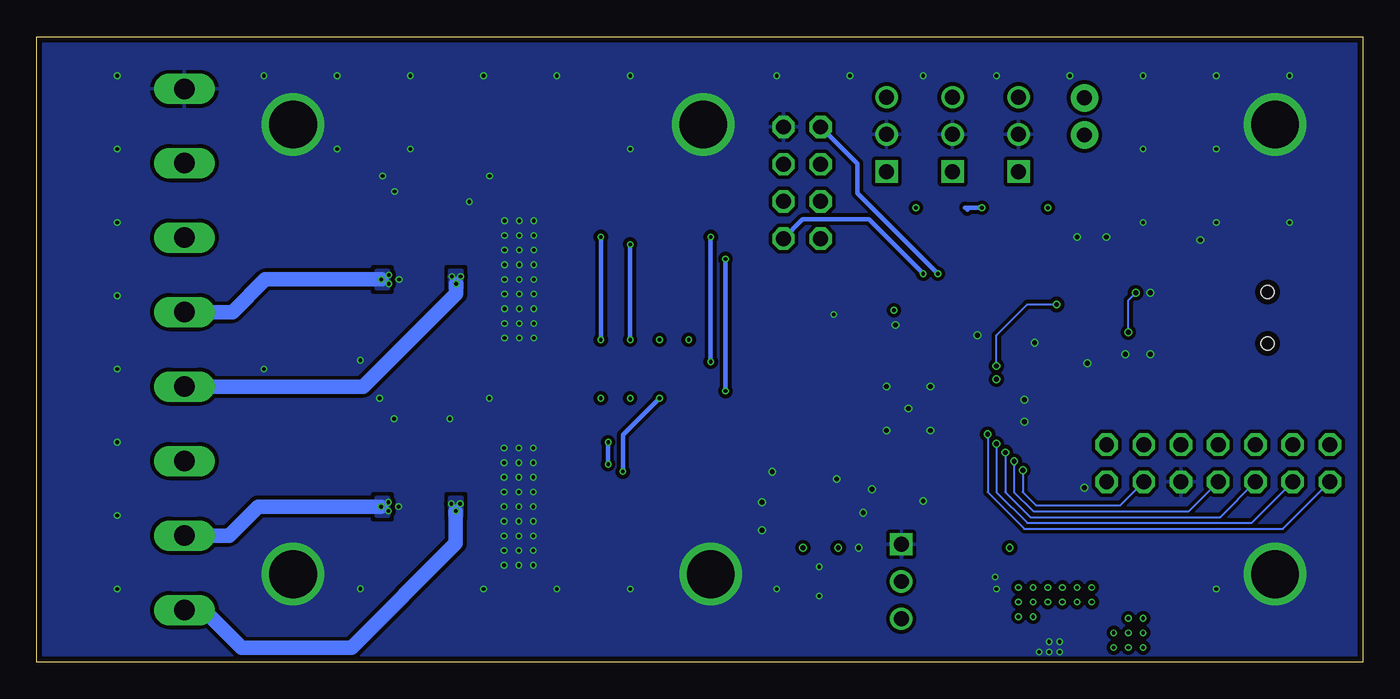
[diagram p7: board, bottom side, seen from below]

Size 90.5 x 42.67 mm. Coordinates in mm from the lower left corner, seen from the top.
Outline: 90.5,0 90.5,42.67 0,42.67 0,0 90.5,0
Copper layers (1*2*15*16): Top 0.035559375mm / dielectric 0.17018125mm / Route2 0.01778125mm / dielectric 47mil / Route15 0.01778125mm / dielectric 0.17018125mm / Bottom 0.035559375mm
Design rules "OSHPark-4layer *": minimum track width 5mil, minimum drill 10mil, track to track 5mil, track to pad 5mil, pad to pad 5mil, via to via 5mil, smd to smd 5mil, copper to edge 15mil, drill to drill 6mil, minimum pad ring 4mil, minimum via ring 4mil, stop-mask expansion 2.5mil, vias tented up to drill 14mil, thermal gap 10mil
tRestrict: area 70.2,3.2 to 75.8,8.8

### Footprints (pad centres in the part's own frame; a part is rotated, then mirrored left to right if it is on the bottom)
C0603 = smd 1.1 x 1: 1 -0.85,0; 2 0.85,0
875105344010 = smd 3.5 x 1.6: P$1 -2.55,0; P$2 2.55,0
-DRL = smd 0.3 x 0.45: 1 -0.5,-0.675; 2 0,-0.675; 3 0.5,-0.675; 4 0.5,0.675; 5 -0.5,0.675
SOD123 = smd 1.4 x 1.4: A 1.9,0; C -1.9,0
DB2X20700L = smd 0.8 x 1.1: P$1 -1.55,0; P$2 1.55,0
1X02 = drill 1.016 pad 1.88: 1 0,0; 2 2.54,0
VLS201610ET = smd 0.65 x 1.6: P$1 -0.675,0; P$2 0.675,0
ABM8 = smd 1.3 x 1.05: 1 -1.15,-0.925; 2 1.15,-0.925; 3 1.15,0.925; 4 -1.15,0.925
R0603 = smd 1 x 1.1: 1 -0.85,0; 2 0.85,0
MA07-2 = drill 1.016 octagon: 1 -7.62,-1.27; 2 -7.62,1.27; 3 -5.08,-1.27; 4 -5.08,1.27; 5 -2.54,-1.27; 6 -2.54,1.27; 7 0,-1.27; 8 0,1.27; 9 2.54,-1.27; 10 2.54,1.27; 11 5.08,-1.27; 12 5.08,1.27; 13 7.62,-1.27; 14 7.62,1.27
MA03-1-ROUND = drill 1.016 square: 1 -2.54,0 | drill 1.016: 2 0,0; 3 2.54,0
-RGC-N64 = smd 0.85 x 0.28: 1 -4.475,3.75; 2 -4.475,3.25; 3 -4.475,2.75; 4 -4.475,2.25; 5 -4.475,1.75; 6 -4.475,1.25; 7 -4.475,0.75; 8 -4.475,0.25; 9 -4.475,-0.25; 10 -4.475,-0.75; 11 -4.475,-1.25; 12 -4.475,-1.75; 13 -4.475,-2.25; 14 -4.475,-2.75; 15 -4.475,-3.25; 16 -4.475,-3.75; 33 4.475,-3.75; 34 4.475,-3.25; 35 4.475,-2.75; 36 4.475,-2.25; 37 4.475,-1.75; 38 4.475,-1.25; 39 4.475,-0.75; 40 4.475,-0.25; 41 4.475,0.25; 42 4.475,0.75; 43 4.475,1.25; 44 4.475,1.75; 45 4.475,2.25; 46 4.475,2.75; 47 4.475,3.25; 48 4.475,3.75 | smd 0.28 x 0.85: 17 -3.75,-4.475; 18 -3.25,-4.475; 19 -2.75,-4.475; 20 -2.25,-4.475; 21 -1.75,-4.475; 22 -1.25,-4.475; 23 -0.75,-4.475; 24 -0.25,-4.475; 25 0.25,-4.475; 26 0.75,-4.475; 27 1.25,-4.475; 28 1.75,-4.475; 29 2.25,-4.475; 30 2.75,-4.475; 31 3.25,-4.475; 32 3.75,-4.475; 49 3.75,4.475; 50 3.25,4.475; 51 2.75,4.475; 52 2.25,4.475; 53 1.75,4.475; 54 1.25,4.475; 55 0.75,4.475; 56 0.25,4.475; 57 -0.25,4.475; 58 -0.75,4.475; 59 -1.25,4.475; 60 -1.75,4.475; 61 -2.25,4.475; 62 -2.75,4.475; 63 -3.25,4.475; 64 -3.75,4.475 | smd 4.25 x 4.25: PAD 0,0
LXDC2HN33A-136 = smd 0.85 x 0.6: 1 0.675,0.55; 2 -0.675,0.55; 3 -0.675,-0.55; 4 0.675,-0.55
2N7002P-235 = smd 0.6 x 0.7: 1 0.95,1; 2 -0.95,1; 3 0,-1
-PWP = smd 0.3 x 1.6: 1 -4.225,-2.8; 2 -3.575,-2.8; 3 -2.925,-2.8; 4 -2.275,-2.8; 5 -1.625,-2.8; 6 -0.975,-2.8; 7 -0.325,-2.8; 8 0.325,-2.8; 9 0.975,-2.8; 10 1.625,-2.8; 11 2.275,-2.8; 12 2.925,-2.8; 13 3.575,-2.8; 14 4.225,-2.8; 15 4.225,2.8; 16 3.575,2.8; 17 2.925,2.8; 18 2.275,2.8; 19 1.625,2.8; 20 0.975,2.8; 21 0.325,2.8; 22 -0.325,2.8; 23 -0.975,2.8; 24 -1.625,2.8; 25 -2.275,2.8; 26 -2.925,2.8; 27 -3.575,2.8; 28 -4.225,2.8 | smd 5.18 x 3.1: PAD 0,0
ESP8266 = drill 1.016 octagon: 1 4.04,3.81; 2 1.5,3.81; 3 4.04,1.27; 4 1.5,1.27; 5 4.04,-1.27; 6 1.5,-1.27; 7 4.04,-3.81; 8 1.5,-3.81
UX60-MB-5ST = smd 2 x 0.5: 1 2.25,1.6; 2 2.25,0.8; 3 2.25,0; 4 2.25,-0.8; 5 2.25,-1.6 | smd 2.2 x 2.5: M1 -3.3,-4.2; M2 -3.3,4.2; M3 2,4.2; M4 2,-4.2 | hole 0.9: 0,-1.75; 0,1.75
MSTBA8 = drill 1.397 long: 1 -17.78,5.08; 2 -12.7,5.08; 3 -7.62,5.08; 4 -2.54,5.08; 5 2.54,5.08; 6 7.62,5.08; 7 12.7,5.08; 8 17.78,5.08

### Placement (x,y rotation side)
C1  13,2 180 top
C2  19,7 180 top
C3  13,4 180 top
C4  35,6.5 0 top
C5  39,10.9 0 top
C6  35,4.5 0 top
C7  34.1,23.7 0 top
C8  39,9 0 top
C9  35,9 180 top
C10  38.4,13 0 top
C11  21,19.9 180 top
C12  24.9,10.9 180 top
C13  21,17.9 0 top
C14  21,11.9 180 top
C15  19.5,27 90 top
C16  17.5,27 90 top
C21  23.72,21.01 90 top
C22  26,7 180 top
C25  62.37,21.31 90 top
C26  64.57,22.61 90 top
C27  68.37,22.61 270 top
C28  72.11,29.43 0 top
C29  66.07,30.11 90 top
C30  61.5,33.5 180 top
C31  65,33.5 0 top
C32  62.4,5.81 90 top
C33  64.6,7.11 90 top
C34  68.4,7.11 270 top
C35  72.11,15.4 0 top
C36  66.1,14.61 90 top
C37  61.5,18 180 top
C38  65,18 0 top
D1  15.2,23.9 90 top
D2  13,27.5 180 top
D3  19,32 90 top
JP1  19,38.5 270 top
L2  21.5,26.3 270 top
Q2  21,14.9 270 top
R1  23.5,31 180 top
R2  28,5 180 top
R3  24.9,9 180 top
R4  12,24.8 180 top
R5  12,23 180 top
R6  17.5,22.7 90 top
R7  19.5,22.7 270 top
R8  12,21 180 top
R9  28,3 0 top
R10  35,2.5 180 top
R11  38.5,2.5 180 top
R18  66.47,22.61 270 top
R19  63.97,26.11 180 top
R20  64.17,30.11 90 top
R21  62.27,30.11 270 top
R22  52,20 90 top
R23  50,20 90 top
R24  66.5,7.11 270 top
R25  64,10.61 180 top
R26  64.2,14.61 90 top
R27  62.3,14.61 270 top
R28  46,20 270 top
R29  48,20 270 top
R30  28,31 180 top
R31  32.5,31 180 top
SV1  9.87,13.57 0 top
SV2  31.5,5.5 270 top
SV3  23.5,36 90 top
SV4  28,36 90 top
SV5  32.5,36 90 top
U1  31,17.3 90 top
U2  19,2 0 top
U3  29,10 90 top
U4  57.57,26.11 90 top
U6  57.6,10.61 90 top
U8  24.5,28.5 270 top
U9  28,28.5 270 top
U10  31.5,28.5 270 top
U15  35.5,32.7 0 top
X1  6.5,23.5 0 top
X2  85.5,21.34 90 top

### Tracks (layer width: path | path; a pad name or v marks a point on that pad's centre or on a via)
3V3OUT_1
  Top 0.3: U4.15 53,30.34 52,31.34 52,33.5 53,34.5 61.5,34.5 62.35,33.65 C30.1 C31.1 64.15,30.98 R20.2
3V3OUT_2
  Top 0.3: R26.2 64.15,15.51 C38.1 C37.1 62.35,18.65 62,19 54,19 53,18 53,15.5 53.66,14.84 U6.15
!FAULT_1  (via drill 0.25)
  Top 0.3: U4.18 50.12,28.39 v50,28.5 | v50,22 R23.2
  Bottom 0.3: v50,28.5 v50,22
!FAULT_2  (via drill 0.25)
  Top 0.3: U6.18 50.62,12.88 v50.5,13 | v48,18 R29.2
  Bottom 0.3: v50.5,13 50.5,15.5 v48,18
!RESET  (via drill 0.25)
  Top 0.3: U4.16 45.19,29.68 v44.5,29 | U1.25 41.55,17.55 v44.5,20.5 44.5,19 49.31,14.19 U6.16
  Bottom 0.3: v44.5,29 v44.5,20.5
!SLEEP_1  (via drill 0.25)
  Top 0.3: U4.17 52.03,29.04 v52,29 | v52,22 R22.2
  Bottom 0.3: v52,29 v52,22
!SLEEP_2  (via drill 0.25)
  Top 0.3: U6.17 51.53,13.54 v51.5,13.5 | v51.5,15 49.5,15 46,18.5 R28.2
  Bottom 0.3: v51.5,13.5 v51.5,15
+3V3  (via drill 0.25, 0.33)
  Top 0.3: R23.1 v50,18 | R22.1 v52,18 | U1.40 31.25,23.25 v32,24 33.05,24 C7.1 33.25,23.75 | R3.2 24.05,7.85 v24.1,7.8 | U2.3 16.55,1.45 v16,2 v15,2 C1.1 C3.1 | v48,22 R29.1 | v46,22 R28.1 | U1.15 34.25,11.95 34.6,11.6 36.8,11.6 37.5,10.9 C5.1 C8.1 38.15,7.85 v38.2,7.8 | U1.11 32.25,11.75 33,11 35,11 35.85,10.15 C9.1 35.8,8.95 v35.8,7.8
  other vias: 15,3 16,3 17,2 17,1 16,1 15,1
  pour Route15 (rank 6): 0,93.5 143.5,93.5 143.5,0 0,0
  pour Top (isolate 0.2): 18.5,0 18.5,2 18,2 15,5 13.2,5 13.2,0
+5V  (via drill 0.25, 0.33)
  Top 0.152: U1.53 25.25,19.05 v25,19.3
  Top 0.3: R1.2 v21.5,31 21.5,38.5 | R30.2 v26,31 | R31.2 v30.5,31
  Top 1.016: SV5.3 32,38.54 | 32,38.54 SV4.3 SV3.3 23.46,38.5 21.5,38.5 JP1.1 | 32.04,38.5 32,38.54
  Route15 0.3: SV2.3 31.5,1.5
  Bottom 0.3: v26,31 R30.2 27,30.85
  other vias: 21.5,5.1 20.5,5.1 19.5,5.1 18.5,5.1 21.5,4.1 19.5,4.1 20.5,4.1 18.5,4.1 22.5,5.1 22.5,4.1 22.5,3.1 23.5,3.1 23.5,4.1 23.5,5.1
  pour Top (isolate 0.2): 18,8 23.5,8 24,7.5 24,2.5 18.5,2.5 18,3
  pour Route15 (isolate 0.254): 17,43 17,31 18,30 34,30 35,31 35,38 37,40 86,40 87,39 87,31 90,28 91,28 92,29 92,42 91,43
  pour Route15: 25.5,20 13,20 9,16 9,9 11,7 17,7 18,6 18,1 19,0 92,0 92,26 87,31 79,31 78,30 78,28 79,27 86,27 88,25 88,4 86,2 27,2 23,6 23,8 21,10 14,10 13,11 13,15 14,16 17,16 19,18 21,18 22,19 25.5,19
AIN_1
  Top 0.3: U1.3 28.25,12.25 29,11.5 29,8 30,7 30,2 30.5,1.5 35.5,1.5 35.85,1.85 R10.1 R11.2
BAT_IN
  Top 0.3: R9.2 28.85,2.15 30,1 87.5,1 89.5,3 89.5,27.5 82.97,34.03 X2.7
BAT_IN_HALF
  Top 0.3: U1.1 27.25,7.1 C22.1 27.15,6.7 R2.2 R9.1
CHPD
  Top 0.3: U1.43 29.75,24.35 32.1,26.7 33.1,26.7 34.6,28.2 34.6,31.57 U15.4
CP1
  Top 0.3: U4.2 61.99,22.54 C25.2
CP2
  Top 0.3: U4.1 61.3,21.89 61.47,21.71 61.47,20.81 61.82,20.46 C25.1
CP3
  Top 0.3: U6.2 62.02,7.04 C32.2
CP4
  Top 0.3: U6.1 61.33,6.38 61.5,6.21 61.5,5.31 61.85,4.96 C32.1
D+
  Top 0.152: X1.3 10.65,23.5 R5.2
D-
  Top 0.152: X1.2 10.65,24.3 R4.2
DECAY  (via drill 0.25)
  Top 0.3: U1.33 37.77,21.77 v43.5,27.5 43.73,27.73 U4.19 | v43.5,18.5 44,18.5 50.27,12.23 U6.19
  Bottom 0.3: v43.5,27.5 v43.5,18.5
GND  (via drill 0.25, 0.33, 3.25)
  Top 0.152: C15.2 19.5,28 | C8.2 v41,9 | C5.2 v41,10.9 | C10.2 v40.3,13 | v33.5,11.8 33.75,11.85 U1.14 33.75,14.05 34,14.3 34.75,13.55 U1.16 | Q2.2 20.07,11.97 C14.2 v19,11.9 | C13.2 v23.1,17.9 23.45,17.55 U1.56 27.95,17.55 28,17.5 | Q2.4 22.75,16.05 v23.1,16.4 | 16.5,20.7 v16.2,21 17.05,21.85 R6.1 | C11.2 19.3,19.9 v18.8,20.4 | D1.4 14.53,25.18 v14.5,25.2 | U1.49 26.52,22.07 v26.3,22.3 | C21.2 22.46,21.86 v22.4,21.8 | U1.10 31.75,13.75 32,14 | 31.75,22.85 v31.9,23 | 32,20.5 31.75,20.75 U1.39
  Top 0.3: R19.1 v65.77,26.11 | R25.1 v65.8,10.61 | U1.39 31.75,22.75 32,23
  Top 0.406: D2.A v11.1,28.8 | C16.2 v17.5,29 | v19.5,29 19.5,28 | R8.1 v14.5,21
  other vias: 31,17.3 32.5,18.8 29.5,15.8 32.5,15.8 29.5,18.8 66.07,32.11 60.97,31.41 57.57,26.11 57.57,27.11 56.57,27.11 56.57,26.11 56.57,25.11 57.57,25.11 58.57,25.11 58.57,26.11 58.57,27.11 58.57,28.11 57.57,28.11 56.57,28.11 56.57,29.11 56.57,30.11 57.57,30.11 57.57,29.11 58.57,29.11 58.57,30.11 56.57,24.11 56.57,23.11 56.57,22.11 57.57,22.11 57.57,23.11 57.57,24.11 58.57,24.11 58.57,23.11 58.57,22.11 59.59,33.17 66.89,33.17 66.1,16.61 62.3,16.61 57.6,10.61 57.6,11.61 56.6,11.61 56.6,10.61 56.6,9.61 57.6,9.61 58.6,9.61 58.6,10.61 58.6,11.61 58.6,12.61 57.6,12.61 56.6,12.61 56.6,13.61 56.6,14.61 57.6,14.61 57.6,13.61 58.6,13.61 58.6,14.61 56.6,8.61 56.6,7.61 56.6,6.61 57.6,6.61 57.6,7.61 57.6,8.61 58.6,8.61 58.6,7.61 58.6,6.61 59.6,18 67.1,18 68.4,20.6 36.1,23.71 20.7,1.4 20.7,0.7 21.4,0.7 21.4,1.4 22.1,0.7 6,36.67 45,36.67 73,36.67 6,6 44.5,6 73,6 37.1,4.51 37.1,6.51 25.1,5.81 68.4,5.01 10,5 25,5 40,5 50,5 55,5 60,5 85,5 85,10 85,15 85,20 85,25 75,20 85,35 85,30 85,40 75,40 70,40 70,35 65,40 65,35 60,40 55,40 50,40 50,35 40,40 35,40 30,40 25,40 20,40 15,40 15,35 15,30 10,30 10,35 10,40 5,40 5,30 30,11 34.1,10.2 34.4,7.8 35.9,12.5
  pour Route2: 0,93.5 143.5,93.5 143.5,0 0,0
  pour Top (isolate 0.406, rank 6): 0,93.5 143.5,93.5 143.5,0 0,0
  pour Bottom (isolate 0.254, rank 6): 0,93.5 143.5,93.5 143.5,0 0,0
GPIO0
  Top 0.3: U15.5 38.3,30.19 38.3,28.3 37.5,27.5 35.5,27.5 33.5,25.5 32.5,25.5 30.75,23.75 U1.41
GPIO2
  Top 0.3: U15.3 41.5,32.01 41.5,26.5 37.7,22.7 32.5,22.7 32.25,22.45 U1.38
I0_1
  Top 0.3: U1.30 39.05,20.05 44.13,25.14 U4.23
I0_2
  Top 0.3: U1.22 43.45,16.05 49.87,9.63 U6.23
I1_1
  Top 0.3: U1.29 39.58,19.55 44.52,24.48 U4.24
I1_2
  Top 0.3: U1.21 42.95,15.55 49.52,8.98 U6.24
I2_1
  Top 0.3: U1.28 40.05,19.05 44.84,23.84 U4.25
I2_2
  Top 0.3: U6.25 49.16,8.34 42.45,15.05 U1.20
I3_1
  Top 0.3: U1.27 40.55,18.55 45.19,23.18 U4.26
I3_2
  Top 0.3: U6.26 48.81,7.68 41.95,14.55 U1.19
I4_1
  Top 0.3: U1.26 41.05,18.05 45.53,22.54 U4.27
I4_2
  Top 0.3: U6.27 54.03,7.04 54,7 48.5,7 41.45,14.05 U1.18
IN1_1
  Top 0.3: U1.31 38.55,20.55 44.44,26.43 U4.21
IN1_2
  Top 0.3: U1.23 43.95,16.55 49.56,10.94 U6.21
IN2_1
  Top 0.3: U1.32 38.05,21.05 44.09,27.09 U4.20
IN2_2
  Top 0.3: U1.24 44.45,17.05 49.91,11.59 U6.20
ISEN
  Top 0.3: 62.87,26.36 R19.2 | U4.6 62.15,25.14 R19.2 | U4.9 62.15,27.09 R19.2
ISEN1
  Top 0.3: 62.9,10.86 R25.2 | U6.6 62.17,9.63 R25.2 | U6.9 62.17,11.59 R25.2
MSP_D+
  Top 0.152: U1.50 25.95,20.55 25.5,21 25.5,22.5 24.45,23.55 R7.1 19.15,23.9 17.5,23.9 | R5.1 13.4,23 13.8,23.4 D1.5 15,23.4 15.5,23.9 17.5,23.9 | R6.2 17.5,23.9
MSP_D-  (via drill 0.33)
  Top 0.152: v20.9,24.4 D1.3 15.5,24.4 15,23.9 14,23.9 13.1,24.8 R4.1 | U1.52 25.65,19.55 v25,20.2
  Bottom 0.152: v25,20.2 25,22.3 22.9,24.4 v20.9,24.4
MSP_PUR
  Top 0.152: U1.51 25.85,20.05 25.1,20.8 25.1,22.3 24.3,23.1 21.6,23.1 20.35,21.85 R7.2
N$1
  Top 0.3: R2.1 28.85,6.65 28,7.5 U3.2
N$2
  Top 0.152: U1.55 24.15,18.05 22.3,19.9 C11.1
N$3
  Top 0.3: U1.17 36.15,13.55 36.7,13 C10.1
N$4
  Top 0.3: U1.2 27.75,11.2 U3.1
N$5
  Top 0.152: U1.57 20.45,17.05 | 20.45,17.05 20.2,16.8 20.2,16.27 Q2.1 | C13.1 20.15,17.35 20.45,17.05
N$6
  Top 0.152: C14.1 21.93,11.97 Q2.3 21.93,13.93 24.55,16.55 U1.58
N$7
  Top 0.406: R8.2 10.6,21 9.7,21.9 X1.5
N$8
  Top 0.3: R10.2 34,2.5 33,3.5 33,4 SV2.2
N$9
  Top 0.813: L2.P$1 21.5,29.3 20.35,30.45 D3.P$1
N$11
  Top 0.813: D3.P$2 JP1.2
N$12
  Top 0.3: U8.2 25.5,30 25,30.5 R1.1 24.35,32.11 SV3.1
N$13
  Top 0.3: 34.25,6.6 C4.1 | C4.1 C6.1 | U1.9 31.25,11.75 33,10 33,8 34.15,6.85 C4.1
N$14
  Top 0.3: U9.2 29,30.35 R30.1 28.85,32.11 SV4.1
N$16
  Top 0.3: SV5.1 33.35,32.11 R31.1 33.35,29.85 33,29.5 32.55,29.5 U10.2
OUT1_1  (via drill 0.25)
  Top 0.3: U4.10 65.75,27.73 66.57,26.91 66.57,26.51 | U4.5 65.94,24.48 66.57,25.11 66.57,26.51 | 66.57,26.51 v66.47,26.41
  Bottom 1: X2.5 77.12,23.88 74.89,26.11 v66.97,26.11
  other vias: 66.47,25.81
  pour Bottom: 66.5,26.7 66.5,25.5 67.3,25.5 67.3,26.7
  pour Top: 66.5,26.7 66.5,25.5 67.3,25.5 67.3,26.7
OUT1_2  (via drill 0.25)
  Top 0.3: U6.10 65.78,12.23 65.78,12.22 66.5,11.5 v66.5,10.91 | U6.5 65.97,8.98 66.5,9.51 v66.5,10.31
  Bottom 1: X2.2 77.36,8.63 75.39,10.61 v67,10.61
  pour Bottom: 66.5,11.2 66.5,10 67.3,10 67.3,11.2
  pour Top: 66.5,11.2 66.5,10 67.3,10 67.3,11.2
OUT2_1  (via drill 0.25)
  Top 0.3: U4.8 61.84,26.43 v62.17,26.31
  Bottom 1: X2.4 68.2,18.8 61.87,25.13 v61.87,25.81
  other vias: 61.57,26.31
  pour Top (no thermals): 59.67,25.71 62.27,25.71 62.27,26.51 59.67,26.51
  pour Bottom: 61.5,26.7 61.5,25.5 62.3,25.5 62.3,26.7
OUT2_2  (via drill 0.25)
  Bottom 1: X2.1 79.06,3.56 76.5,1 69,1 61.9,8.1 v61.9,10.31
  other vias: 61.6,10.81 62.2,10.81
  pour Top (no thermals): 59.7,10.21 62.3,10.21 62.3,11.01 59.7,11.01
  pour Bottom: 61.5,11.2 61.5,10 62.3,10 62.3,11.2
RESET  (via drill 0.33)
  Top 0.152: U1.64 25.65,13.55 25.2,13.1 | 25.2,13.1 v23.2,13.1 | C12.1 25.75,12.55 25.2,13.1
  Top 0.3: C12.1 R3.1
  Bottom 0.152: v23.2,13.1 23.2,11.6 22.3,10.7 16.55,10.7 SV1.11
RST
  Top 0.3: U1.42 30.25,24.05 32.3,26.1 33.3,26.1 35.2,28 35.2,29.7 36.93,31.43 U15.6
RXI  (via drill 0.25)
  Top 0.3: U1.45 28.75,25.25 v30,26.5
  Bottom 0.3: v30,26.5 33.7,30.2 38.23,30.2 U15.7
SERVO1
  Top 0.3: U1.48 27.25,25.8 U8.1
SERVO2
  Top 0.3: U1.47 27.75,26.3 U9.1
SERVO3
  Top 0.3: U1.44 29.25,24.75 32,27.5 32.45,27.5 U10.1
TCK  (via drill 0.33)
  Top 0.152: U1.63 25.55,14.05 25.2,13.7 v23.8,13.7
  Bottom 0.152: SV1.7 11.87,10.3 22.5,10.3 23.8,11.6 v23.8,13.7
TDI  (via drill 0.33)
  Top 0.152: U1.61 25.15,15.05 v25,14.9
  Bottom 0.152: SV1.3 7.59,9.5 22.9,9.5 25,11.6 v25,14.9
TDO  (via drill 0.33)
  Top 0.152: U1.60 v25.6,15.55
  Bottom 0.152: SV1.1 5.45,9.1 23.1,9.1 25.6,11.6 v25.6,15.55
TEST
  Top 0.152: U1.59 25.05,16.05 22.7,13.7 22.7,11.1 22.3,10.7 12.1,10.7 11.2,11.6 11.2,13.51 SV1.8
TMS  (via drill 0.33)
  Top 0.152: U1.62 25.45,14.55 25.2,14.3 v24.4,14.3
  Bottom 0.152: SV1.5 9.73,9.9 22.7,9.9 24.4,11.6 v24.4,14.3
TXO  (via drill 0.25)
  Top 0.3: U1.46 28.25,25.75 v29,26.5
  Bottom 0.3: v29,26.5 34.5,32 34.5,34.01 U15.2
VBUS  (via drill 0.33)
  Top 0.152: D1.1 15.88,22.62 v16,22.5 | 16.2,25.9 16.5,25.6 | v15.5,25.2 15.5,26.2 | C16.1 17.5,25.5 18.85,25.5 C15.1
  Top 0.406: X1.1 9.3,25.1 10.4,26.2 15,26.2 | 15,26.2 15.5,26.2 15.9,26.2 16.5,25.6 17.5,25.6 | C16.1 17.5,25.6 | 17.5,25.6 L2.P$2 | D2.C 14.9,26.3 15,26.2
  Bottom 0.152: v16,22.5 16,24.7 v15.5,25.2
VCP
  Top 0.3: C26.1 64.57,22.31 | U4.3 63.2,23.18 64.12,22.26 C26.1 | C26.1 R18.2
VCP1
  Top 0.3: C33.1 64.6,6.81 | U6.3 63.23,7.68 64.15,6.76 C33.1 | C33.1 R24.2
VM
  Top 0.3: U4.4 64.44,23.84 C26.2 R18.1 | U4.11 66,28.39 | 66,28.39 66.72,28.39 67.2,27.9 | U6.4 64.47,8.34 C33.2 R24.1 | U6.11 67.22,12.88 67.6,12.5 | C36.1 66.1,12.9 | C29.1 66.07,28.45 66,28.39
  pour Top: 64.07,23.81 66.17,23.81 67.77,24.81 67.77,27.51 65.77,28.91 65.77,29.61 66.57,29.61 67.07,30.11 67.07,32.07 67.5,32.5 71,32.5 71.5,32 71.5,16.5 68,16.5 67.5,17 69,18.5 69,22.94 69.07,23.01 64.87,23.01
  pour Top (isolate 0.254): 64.07,8.31 66.17,8.31 68.17,9.31 68.17,12.01 65.77,13.41 65.77,14.11 66.57,14.11 67.07,14.61 67.07,16.57 67.5,17 71,17 71.5,16.5 71.5,14.5 73,13 76,13 79.5,16.5 82.5,16.5 84,15 84,12.5 82.5,11 79,11 75.5,7.5 64.87,7.51
VREF
  pour Top (no thermals): 59.77,29.01 64.47,29.01 64.57,29.11 64.57,29.51 64.47,29.61 61.17,29.61 61.07,29.71 59.77,29.71
VREF1
  pour Top (no thermals): 59.8,13.51 64.5,13.51 64.6,13.61 64.6,14.01 64.5,14.11 61.2,14.11 61.1,14.21 59.8,14.21
VUSB
  Top 0.152: U1.54 24.45,18.55 23.72,19.28 C21.1

### Text on the board
tPlace: nelsonslog.com / RoverPCB / REVB
Document: REVA->REVB / added pin 1 indicators to motor drivers / check diodes D2, D3 for same part / REFDEG R24 and C34 misleading